# Altium schematic sheet 11-Switch_Strapping.SchDoc
size A; SheetNumber: 11; SheetTotal: 11
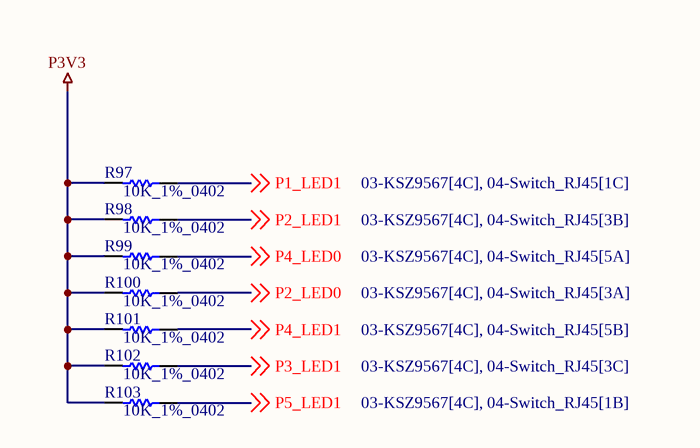
[diagram p0: 11-Switch_Strapping.SchDoc]

## Parts
R97  10K_1%_0402  [RESC1005X40X25NL10T10]
R98  10K_1%_0402  [RESC1005X40X25NL10T10]
R99  10K_1%_0402  [RESC1005X40X25NL10T10]
R100  10K_1%_0402  [RESC1005X40X25NL10T10]
R101  10K_1%_0402  [RESC1005X40X25NL10T10]
R102  10K_1%_0402  [RESC1005X40X25NL10T10]
R103  10K_1%_0402  [RESC1005X40X25NL10T10]

## Nets
P3V3: R97.2 R98.2 R99.2 R100.2 R101.2 R102.2 R103.2
P1_LED1: R97.1 ; off-sheet P1_LED1
P2_LED0: R100.1 ; off-sheet P2_LED0
P2_LED1: R98.1 ; off-sheet P2_LED1
P3_LED1: R102.1 ; off-sheet P3_LED1
P4_LED0: R99.1 ; off-sheet P4_LED0
P4_LED1: R101.1 ; off-sheet P4_LED1
P5_LED1: R103.1 ; off-sheet P5_LED1

## Library data of the parts
R97-R103 = CMP-2002-04694-1: Manufacturer: Bourns; Part Number: CR0402-FX-1002GLF